# Altium schematic sheet Block Diagram.SchDoc: Block Diagram
size A4; DocumentNumber: 1; Revision: 1; SheetNumber: 1; SheetTotal: 4
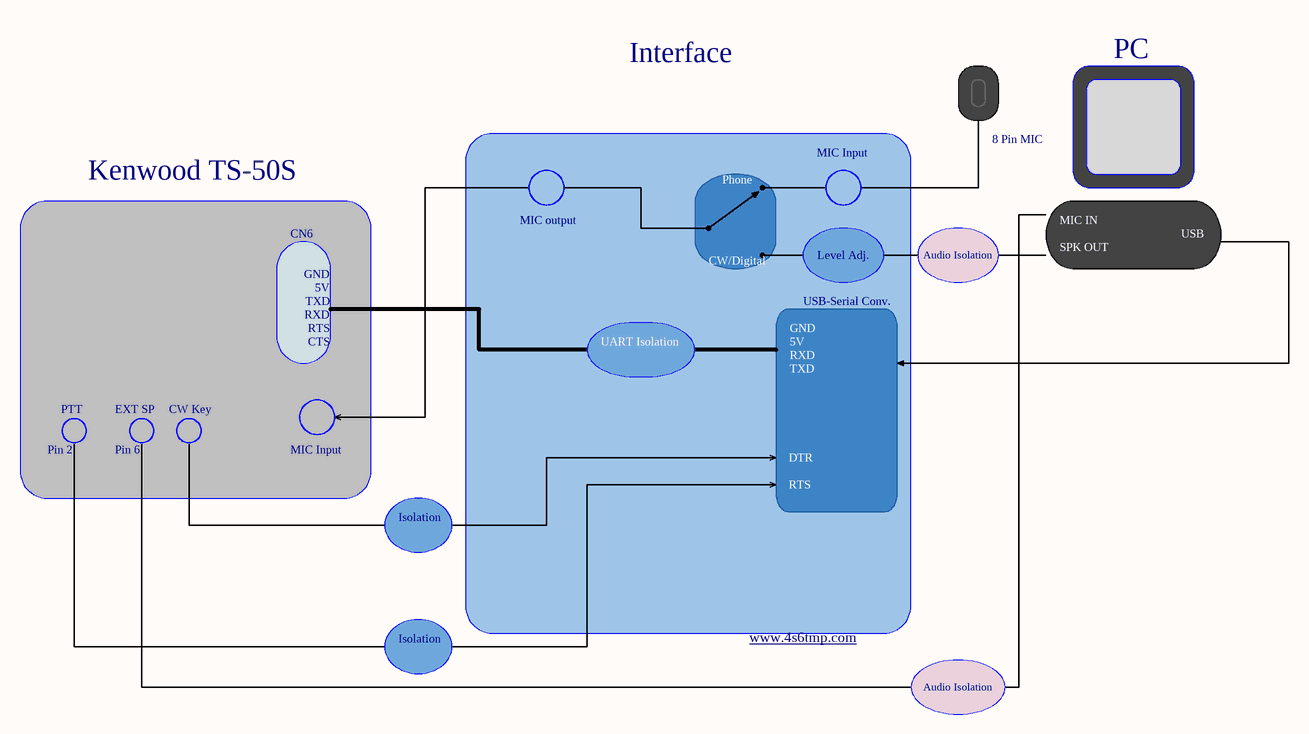
[diagram p0: Block Diagram.SchDoc]

## Notes on the sheet
- Interface
- PC
- Kenwood TS-50S
- Phone
- MIC Input
- 8 Pin MIC
- CN6
- MIC output
- CW/Digital
- Level Adj.
- Audio Isolation
- MIC IN
- SPK OUT
- USB
- GND
- RXD
- TXD
- RTS
- 5V
- USB-Serial Conv.
- CTS
- UART Isolation
- Pin 2
- PTT
- EXT SP
- Pin 6
- CW Key
- DTR
- Isolation
- www.4s6tmp.com <http://www.4s6tmp.com>
- Title
- Size:
- Date:
- A4
- Number:
- Time:
- Revision:
- Sheet
- of
- File: